# EAGLE schematic FLEXQCMV1.3 (EAGLE 7.2.0)
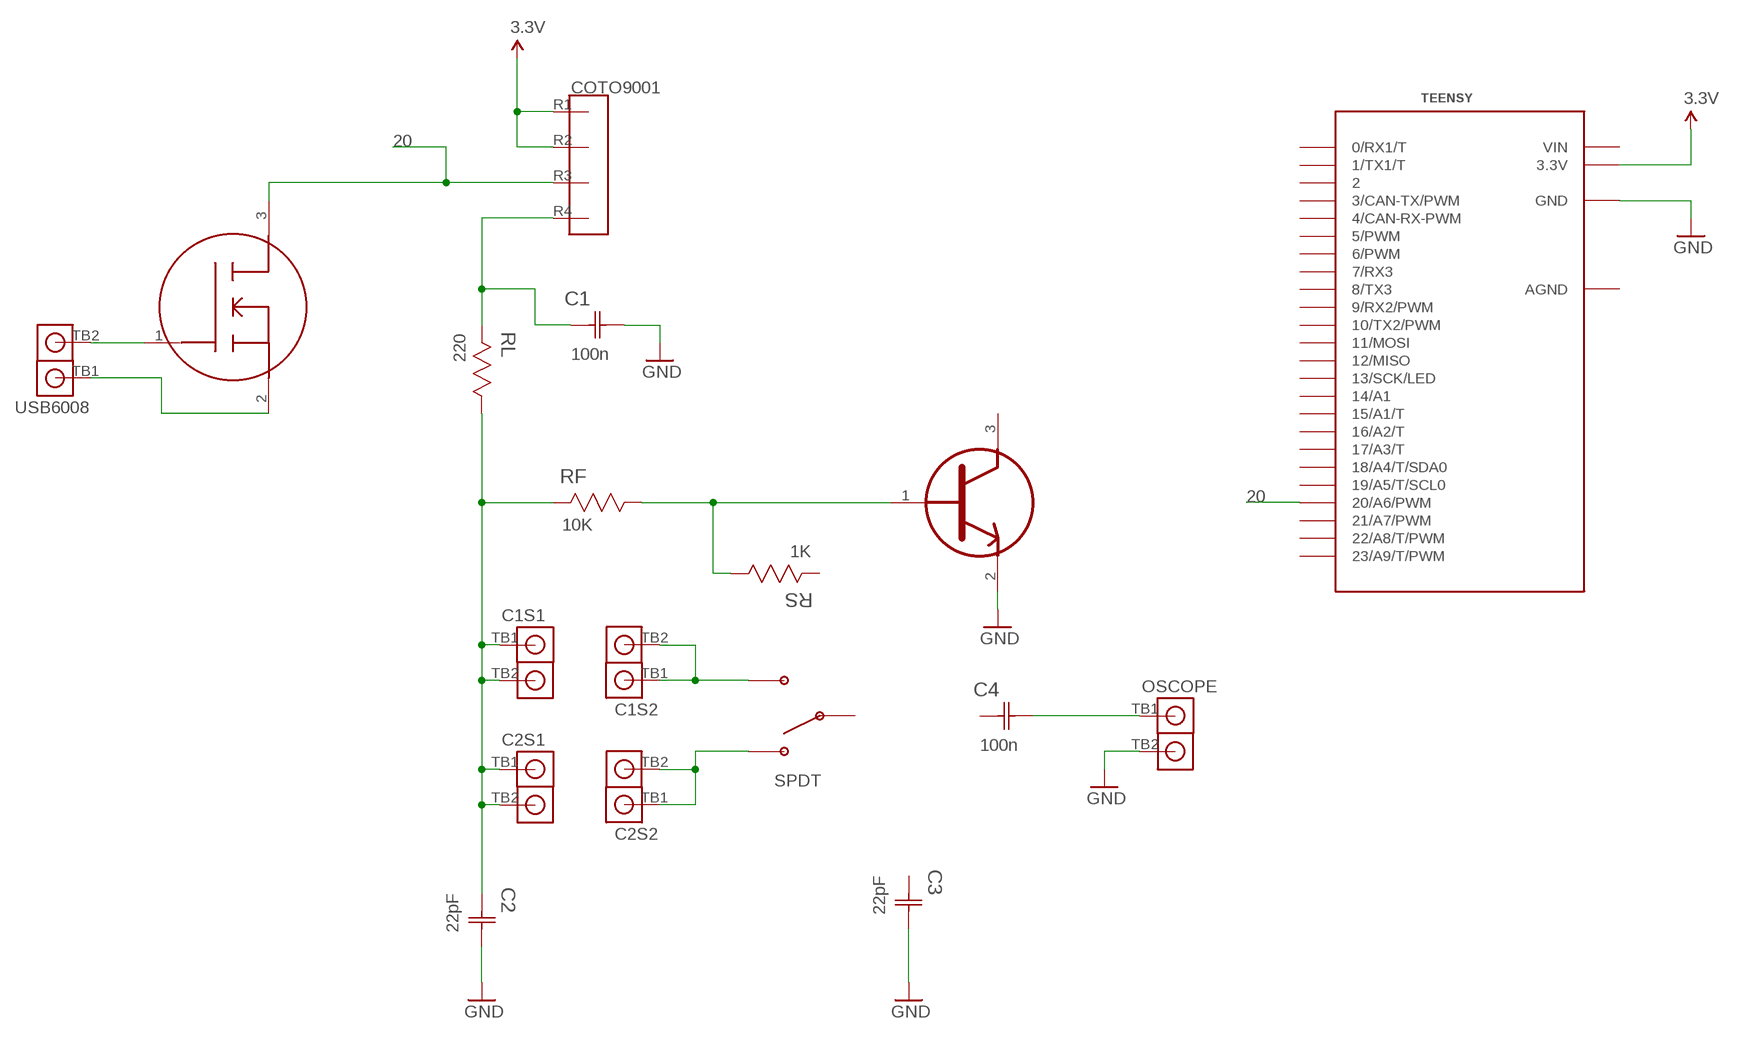
[diagram p0: schematic, sheet 1]

## Parts
C1  100n  C1206C104K1RACTU  [CAPC3216X88N]
C1S1  TERMBLOCKX2  [TERMBLOCKX2]
C1S2  TERMBLOCKX2  [TERMBLOCKX2]
C2  22pF  C1206C220J5GACTU  [CAPC3216X88N]
C2S1  TERMBLOCKX2  [TERMBLOCKX2]
C2S2  TERMBLOCKX2  [TERMBLOCKX2]
C3  22pF  C1206C220J5GACTU  [CAPC3216X88N]
C4  100n  C1206C104K1RACTU  [CAPC3216X88N]
COTO9001  COTO9001  [COTO9001]
OSCOPE  TERMBLOCKX2  [TERMBLOCKX2]
RF  10K  CRCW120610K0FKEA  [RESC3216X71N]
RL  220  CRCW1206220RJNEA  [RESC3216X71N]
RS  1K  CRCW12061K00FKEA  [RESC3216X71N]
SPDT  SPDTSWITCH  [SPDTSWITCH]
TEENSY  TEENSY_3.1_DIL  [TEENSY3-DIL]
U1  FET  2N7002K  [SOT95P230X110-3N]
U2  BJT  BC847C  [SOT95P230X110-3N]
USB6008  TERMBLOCKX2  [TERMBLOCKX2]

## Nets
3.3V: COTO9001.R1 COTO9001.R2 TEENSY.3.3V
20: COTO9001.R3 TEENSY.20/A6(20/A6/PWM) U1.3(D)
GND: C1.2(C2) C2.2(C2) C3.2(C2) OSCOPE.TB2 TEENSY.GND U2.2(E)
N$1: U1.1(G) USB6008.TB2
N$2: U1.2(S) USB6008.TB1
N$3: C1.1(C1) COTO9001.R4 RL.2
N$4: C1S2.TB1 C1S2.TB2 SPDT.SW3
N$5: RF.1 RS.1 U2.1(B)
N$6: C2S2.TB1 C2S2.TB2 SPDT.SW1
N$7: C1S1.TB1 C1S1.TB2 C2.1(C1) C2S1.TB1 C2S1.TB2 RF.2 RL.1
N$8: C4.2(C2) OSCOPE.TB1
Unconnected: C3.1(C1) C4.1(C1) RS.2 SPDT.SW2 TEENSY.0(0/RX1/T) TEENSY.1(1/TX1/T) TEENSY.2 TEENSY.3(3/CAN-TX/PWM) TEENSY.4(4/CAN-RX-PWM) TEENSY.5(5/PWM) TEENSY.6(6/PWM) TEENSY.7(7/RX3) TEENSY.8(8/TX3) TEENSY.9(9/RX2/PWM) TEENSY.10(10/TX2/PWM) TEENSY.11(11/MOSI) TEENSY.12(12/MISO) TEENSY.13(13/SCK/LED) TEENSY.14/A0(14/A1) TEENSY.15/A1(15/A1/T) TEENSY.16/A2(16/A2/T) TEENSY.17/A3(17/A3/T) TEENSY.18/A4(18/A4/T/SDA0) TEENSY.19/A5(19/A5/T/SCL0) TEENSY.21/A7(21/A7/PWM) TEENSY.22/A8(22/A8/T/PWM) TEENSY.23/A9(23/A9/T/PWM) U2.3(C)

## Power pins joined to a net without a drawn wire
AGND: TEENSY.AGND
VIN: TEENSY.VIN

## Library data of the parts
C1 C4 = Kemet_By_element14_Batch_1:C1206C104K1RACTU: CAPACITOR, 1206; MPN: C1206C104K1RACTU; OC_FARNELL: 1414714; OC_NEWARK: 85C2205; SUPPLIER: Kemet; TOLERANCE: ±10%; VALUE: 100nF; VOLTAGERATING: 100V
C1S1 C1S2 C2S1 C2S2 OSCOPE USB6008 = FLEXQCMLIBRARY:TERMBLOCKX2
C2 C3 = Kemet_By_element14_Batch_1:C1206C220J5GACTU: CAPACITOR, 1206; MPN: C1206C220J5GACTU; OC_FARNELL: 1414717; OC_NEWARK: 70K9304; SUPPLIER: Kemet; TOLERANCE: ±5%; VOLTAGERATING: 50V
COTO9001 = FLEXQCMLIBRARY:COTO9001
RF = Vishay_By_element14_Batch_1:CRCW120610K0FKEA: RESISTOR, 1206; MPN: CRCW120610K0FKEA; OC_FARNELL: 1469970; OC_NEWARK: 53K1907; SUPPLIER: Vishay; TOLERANCE: ±1%; VALUE: 10K Ohms; WATTAGE: 0.25W
RL = Vishay_By_element14_Batch_1:CRCW1206220RJNEA: RESISTOR, 1206; MPN: CRCW1206220RJNEA; OC_FARNELL: -; OC_NEWARK: 59M6970; SUPPLIER: Vishay; TOLERANCE: ±5%; VALUE: 220 Ohms; WATTAGE: 0.25W
RS = Vishay_By_element14_Batch_1:CRCW12061K00FKEA: RESISTOR, 1206; MPN: CRCW12061K00FKEA; OC_FARNELL: 1469965; OC_NEWARK: 53K1780; SUPPLIER: Vishay; TOLERANCE: ±1%; VALUE: 1K Ohms; WATTAGE: 0.25W
SPDT = FLEXQCMLIBRARY:SPDTSWITCH
TEENSY = Teensy_3_and_LC_Series_Boards_v1.0:TEENSY_3.1_DIL: Teensy 3.1 or 3.2 in a DIL Layout.
U1 = NXP_By_element14_Batch_1:2N7002K: logic level FET; MPN: 2N7002K; OC_FARNELL: 1758065; OC_NEWARK: -; PACKAGE: SOT-3; SUPPLIER: NXP Semiconductors
U2 = NXP_By_element14_Batch_1:BC847C